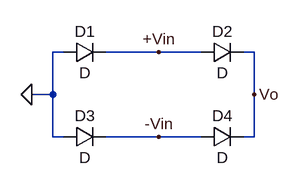
[diagram p0: schematic Puente_de_diodos_onda_completa.asc]
Puente_de_diodos_onda_completa.asc, the LTspice schematic file:
Version 4
SHEET 1 880 680
WIRE 176 160 160 160
WIRE 320 160 240 160
WIRE 384 160 320 160
WIRE 464 160 448 160
WIRE 160 224 160 160
WIRE 160 224 128 224
WIRE 464 224 464 160
WIRE 160 288 160 224
WIRE 176 288 160 288
WIRE 320 288 240 288
WIRE 384 288 320 288
WIRE 464 288 464 224
WIRE 464 288 448 288
FLAG 464 224 Vo
FLAG 320 160 +Vin
FLAG 320 288 -Vin
FLAG 128 224 0
SYMBOL diode 176 176 R270
WINDOW 0 32 32 VTop 2
WINDOW 3 0 32 VBottom 2
SYMATTR InstName D1
SYMBOL diode 384 176 R270
WINDOW 0 32 32 VTop 2
WINDOW 3 0 32 VBottom 2
SYMATTR InstName D2
SYMBOL diode 176 304 R270
WINDOW 0 32 32 VTop 2
WINDOW 3 0 32 VBottom 2
SYMATTR InstName D3
SYMBOL diode 384 304 R270
WINDOW 0 32 32 VTop 2
WINDOW 3 0 32 VBottom 2
SYMATTR InstName D4

The netlist it stands for:
* Puente_de_diodos_onda_completa.asc
D1 0 +Vin D
D2 +Vin Vo D
D3 0 -Vin D
D4 -Vin Vo D
.model D D
.lib standard.dio
.backanno
.end